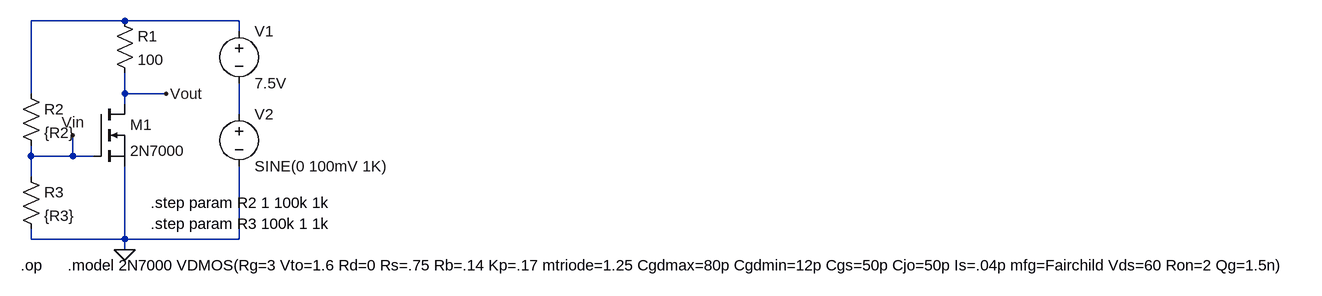
[diagram p0: schematic devre1.asc]
devre1.asc, the LTspice schematic file:
Version 4
SHEET 1 2108 680
WIRE 128 64 -16 64
WIRE 304 64 128 64
WIRE 304 80 304 64
WIRE -16 176 -16 64
WIRE 128 176 128 144
WIRE 192 176 128 176
WIRE 128 192 128 176
WIRE 304 208 304 160
WIRE -16 272 -16 256
WIRE 48 272 48 240
WIRE 48 272 -16 272
WIRE 80 272 48 272
WIRE -16 304 -16 272
WIRE -16 400 -16 384
WIRE 128 400 128 288
WIRE 128 400 -16 400
WIRE 304 400 304 288
WIRE 304 400 128 400
WIRE 128 416 128 400
FLAG 48 240 Vin
FLAG 192 176 Vout
FLAG 128 416 0
SYMBOL res 112 48 R0
SYMATTR InstName R1
SYMATTR Value 100
SYMBOL nmos 80 192 R0
SYMATTR InstName M1
SYMATTR Value 2N7000
SYMBOL voltage 304 64 R0
WINDOW 123 0 0 Left 0
WINDOW 39 0 0 Left 0
SYMATTR InstName V1
SYMATTR Value 7.5V
SYMBOL voltage 304 192 R0
WINDOW 123 0 0 Left 0
WINDOW 39 0 0 Left 0
SYMATTR InstName V2
SYMATTR Value SINE(0 100mV 1K)
SYMBOL res -32 160 R0
SYMATTR InstName R2
SYMATTR Value {R2}
SYMBOL res -32 288 R0
SYMATTR InstName R3
SYMATTR Value {R3}
TEXT 168 344 Left 2 !.step param R2 1 100k 1k
TEXT 168 376 Left 2 !.step param R3 100k 1 1k
TEXT -32 440 Left 2 !.op
TEXT 40 440 Left 2 !.model 2N7000 VDMOS(Rg=3 Vto=1.6 Rd=0 Rs=.75 Rb=.14 Kp=.17 mtriode=1.25 Cgdmax=80p Cgdmin=12p Cgs=50p Cjo=50p Is=.04p mfg=Fairchild Vds=60 Ron=2 Qg=1.5n)

The netlist it stands for:
* devre1.asc
R1 N001 Vout 100
M1 Vout Vin 0 0 2N7000
V1 N001 N002 7.5V
V2 N002 0 SINE(0 100mV 1K)
R2 N001 Vin {R2}
R3 Vin 0 {R3}
.model NMOS NMOS
.model PMOS PMOS
.lib standard.mos
.step param R2 1 100k 1k
.step param R3 100k 1 1k
.op
.model 2N7000 VDMOS(Rg=3 Vto=1.6 Rd=0 Rs=.75 Rb=.14 Kp=.17 mtriode=1.25 Cgdmax=80p Cgdmin=12p Cgs=50p Cjo=50p Is=.04p mfg=Fairchild Vds=60 Ron=2 Qg=1.5n)
.backanno
.end